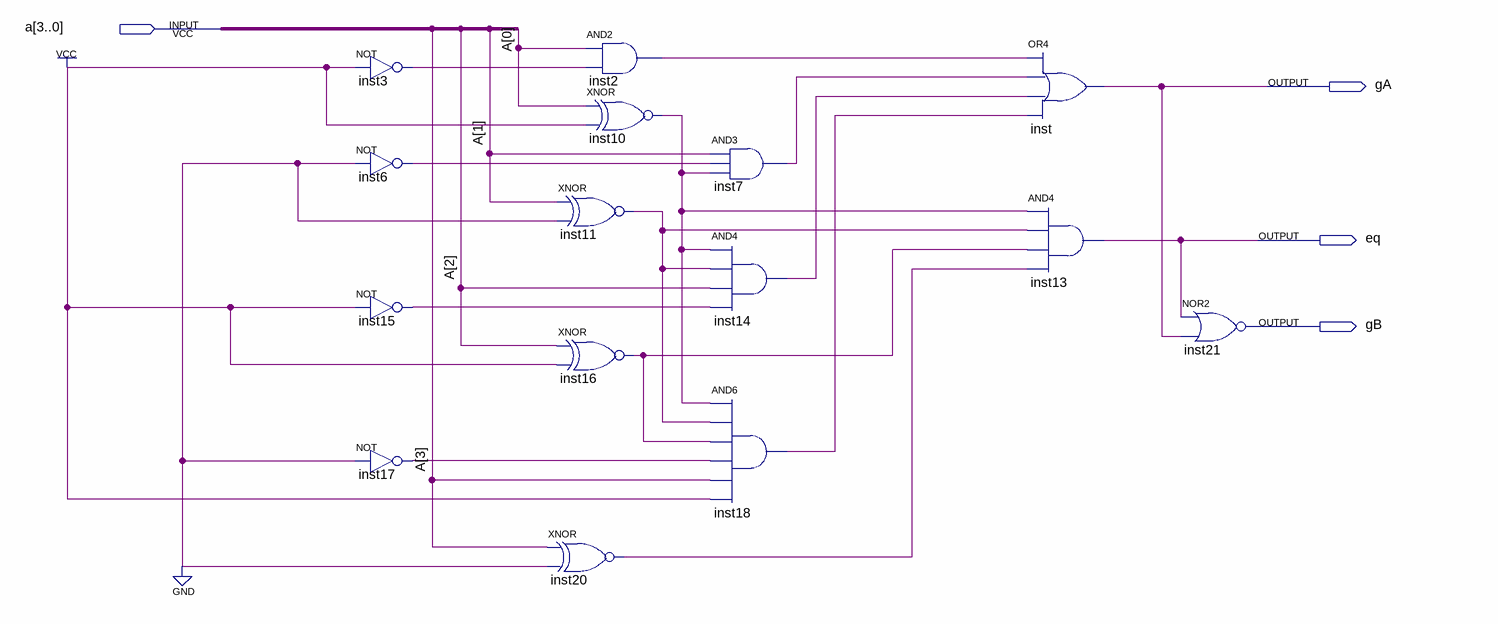
[diagram p0: schematic sheet]
// Quartus schematic compFour.bdf as structural Verilog: 15 symbols, 4 pins
module compFour (
  input  [3:0] a,
  output gA,
  output eq,
  output gB
);

  wire inst2_out, inst3_out, inst6_out, inst7_out, inst10_out, inst11_out, inst14_out, inst15_out,
       inst16_out, inst17_out, inst18_out, inst20_out;

  not inst3 (inst3_out, 1'b1);
  not inst6 (inst6_out, 1'b0);
  not inst15 (inst15_out, 1'b1);
  not inst17 (inst17_out, 1'b0);
  and inst2 (inst2_out, a[0], inst3_out);
  xnor inst10 (inst10_out, a[0], 1'b1);
  xnor inst11 (inst11_out, a[1], 1'b0);
  xnor inst16 (inst16_out, a[2], 1'b1);
  xnor inst20 (inst20_out, a[3], 1'b0);
  and inst7 (inst7_out, a[1], inst6_out, inst10_out);
  and inst14 (inst14_out, inst10_out, inst11_out, a[2], inst15_out);
  and inst18 (inst18_out, inst10_out, inst11_out, inst16_out, inst17_out, a[3], 1'b1);
  or inst (gA, inst2_out, inst7_out, inst14_out, inst18_out);
  and inst13 (eq, inst10_out, inst11_out, inst16_out, inst20_out);
  nor inst21 (gB, eq, gA);
endmodule
